# Altium schematic sheet 10-multimodal-microcontroller-rf.SchDoc
size A; SheetNumber: 7; SheetTotal: 11
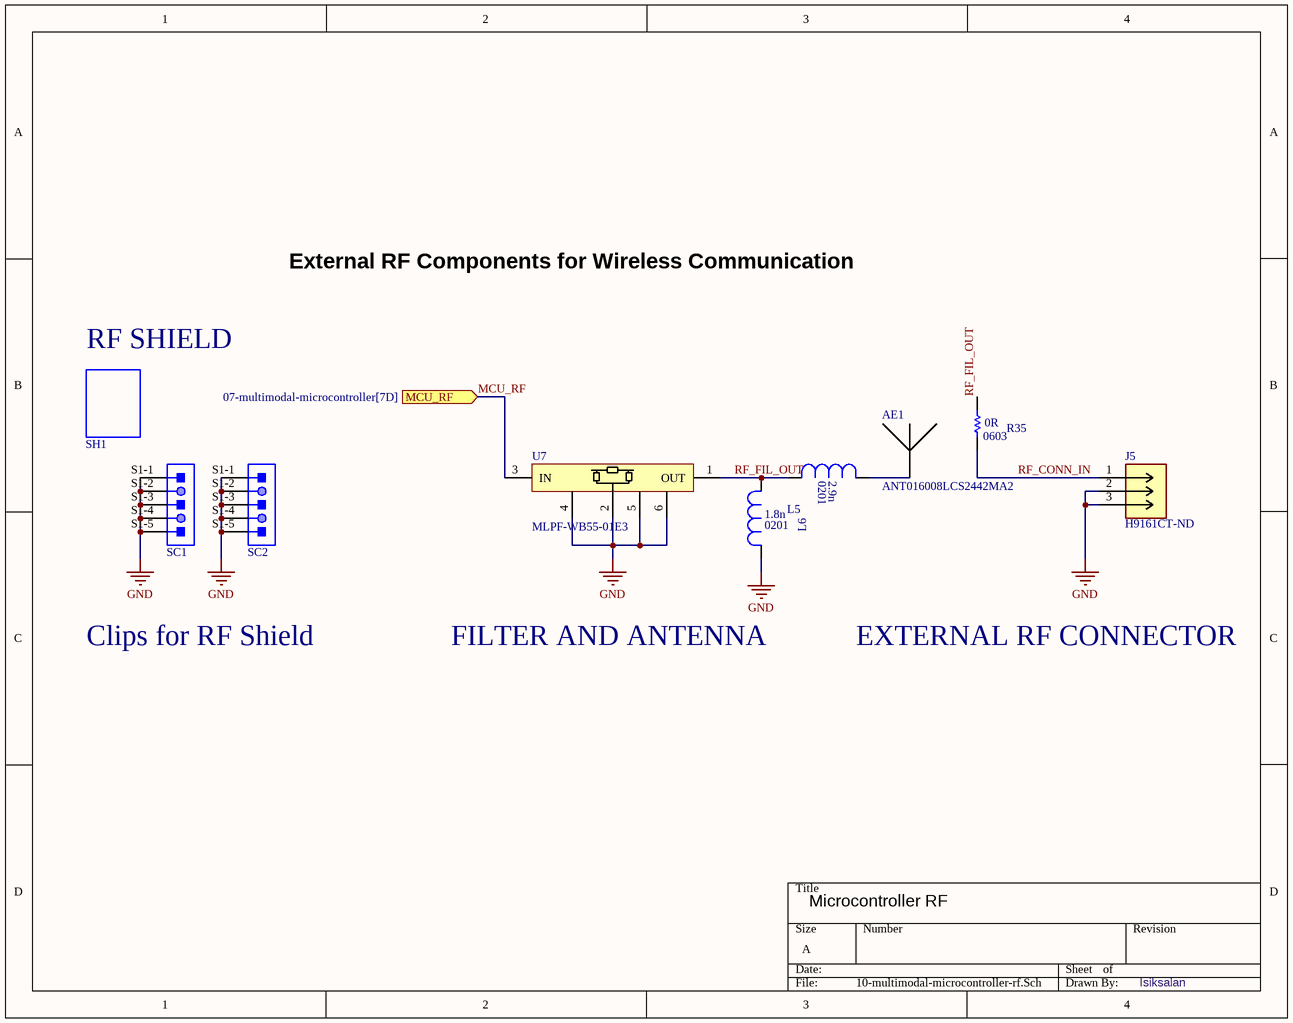
[diagram p0: 10-multimodal-microcontroller-rf.SchDoc]

## Parts
AE1  ANT016008LCS2442MA2  [ANTENNA]
J5  Supplier Part Number 1: H9161CT-ND  [RF-CONNECTOR]  (hidden comment: U.FL-R-SMT(10))
L5  MLG0603P1N8CT000  [INDTDK0201]  (value not drawn)
L6  MHQ0603P2N9ST000  [INDTDK0201]  (value not drawn)
R35  RMCF0603ZT0R00  [RES-STACK-POLE-0603]  (value not drawn)
SC1  S0951-46R  [RF-SHIELD+CLIP]  (value not drawn)
SC2  S0951-46R  [RF-SHIELD+CLIP]  (value not drawn)
SH1  MS190-10C  (value not drawn)
U7  MLPF-WB55-01E3  [Matched-Filter-2.4GHz]

## Ports
MCU_RF (in, see 07-multimodal-microcontroller[7D])

## Nets
GND: J5.2 J5.3 L5.2 SC1.S1-1 SC1.S1-2 SC1.S1-3 SC1.S1-4 SC1.S1-5 SC2.S1-1 SC2.S1-2 SC2.S1-3 SC2.S1-4 SC2.S1-5 U7.2 U7.4 U7.5 U7.6
MCU_RF: U7.3(IN) ; port MCU_RF
RF_CONN_IN: J5.1 R35.1
RF_FIL_OUT: L5.1 L6.2 R35.2 U7.1(OUT)
NetAE1_2: AE1.2 L6.1

## Notes on the sheet
- External RF Components for Wireless Communication
- RF SHIELD
- Clips for RF Shield
- FILTER AND ANTENNA
- EXTERNAL RF CONNECTOR
- Microcontroller RF
- Isiksalan
- (in symbol MHQ0603P2N9ST000) 0201; 2.9n
- (in symbol MLG0603P1N8CT000) 1.8n; 0201
- (in symbol RMCF0603ZT0R00) 0R; 0603

## Library data of the parts
AE1 = ANT016008LCS2442MA2: TDK - ANT016008LCS2442MA2 - Chip Antenna, ISM, 2.442 GHz, 50 Ohm, 1.6mm x 0.8mm x 0.4mm; Number of Bands: 1; Max Frequency: 27MHz; Supplier 1: Digi-Key; Manufacturer: TDK; Manufacturer Part Number: ANT016008LCS2442MA2; RoHS: Yes; Category: RF Antennas; Stock 1: 16359; Pricing 1: 1=0.72000, 10=0.63500, 25=0.59680, 100=0.48700, 250=0.45236, 500=0.38500, 1000=0.30800 (USD); Mount: Surface Mount; Case/Package: 0603; Number of Pins: 6; Packaging: Cut Tape; Termination: Solder; Height: 0.016inch; REACH SVHC: No SVHC; RoHS Compliant: Yes; ComponentLink1URL: http://www.farnell.com/datasheets/2294435.pdf?src-supplier=Farnell; ComponentLink1Description: http://www.farnell.com/datasheets/2294435.pdf?src-supplier=Farnell; ComponentLink2URL: https://product.tdk.com/info/en/documents/data_sheet/rf_ant_ant016008lcs2442ma2_summary_en.pdf?src-supplier=Digi-Key; ComponentLink2Description: https://product.tdk.com/info/en/documents/data_sheet/rf_ant_ant016008lcs2442ma2_summary_en.pdf?src-supplier=Digi-Key; ComponentLink3URL: https://product.tdk.com/info/en/documents/data_sheet/rf_ant_ant016008lcs2442ma2_en.pdf?src-supplier=Avnet; ComponentLink3Description: https://product.tdk.com/info/en/documents/data_sheet/rf_ant_ant016008lcs2442ma2_en.pdf?src-supplier=Avnet; ComponentLink4URL: http://www.farnell.com/datasheets/1932405.pdf?src-supplier=Element14; ComponentLink4Description: http://www.farnell.com/datasheets/1932405.pdf?src-supplier=Element14; Supplier Part Number 1: 445-172405CT-ND
J5 = U.FL-R-SMT(10): CONN U.FL RCPT STR 50 OHM SMD; Manufacturer: Hirose; Copyright: Copyright (C) 2021 Ultra Librarian. All rights reserved.; Manufacturer Part Number: U.FL-R-SMT(10); Digi-Key_Part_Number_1: H9161TR-ND; Digi-Key_Part_Number_2: H9161CT-ND; Digi-Key_Part_Number_3: H9161DKR-ND; Digi-Key_Part_Number_4: H9161TR-NDL; RefDes: RefDes; Type: DEV; Supplier 1: Digi-Key
L5 = MLG0603P1N8CT000: FIXED IND 1.8NH 700MA 100MOHM SM; Supplier 1: Digi-Key; Supplier Part Number 1: 445-172430-1-ND
L6 = MHQ0603P2N9ST000: FIXED IND 2.9NH 450MA 300MOHM SM; Supplier 1: Digi-Key; Supplier Part Number 1: 445-16842-6-ND
R35 = RMCF0603ZT0R00: RES 0 OHM JUMPER 1/10W 0603; Supplier 1: Digi-Key; Supplier Part Number 1: RMCF0603ZT0R00CT-ND
SC1 SC2 = S0951-46R: RFI SHIELD CLIP MINI TIN SMD; Supplier 1: Digi-Key; Supplier Part Number 1: 952-2669-1-ND
SH1 = MS190-10C: RF SHLD COVER 0.563"X0.764" SNAP; Supplier 1: Digi-Key; Supplier Part Number 1: 2333-MS190-10C-ND
U7 = MLPF-WB55-01E3: 2.4 GHz Matched filter companion chip for STM32WB55Cx and STM32WB55Rx; Manufacturer: STMicroelectronics; Supplier 1: Digi-Key; Manufacturer Part Number: MLPF-WB55-01E3; RoHS: Yes; Stock 1: 16369; Pricing 1: 1=0.30000, 10=0.28300, 25=0.26960, 50=0.26100, 100=0.25230, 250=0.23924, 500=0.20010, 1000=0.15530 (USD); ComponentLink1URL: http://www.farnell.com/datasheets/2802556.pdf?src-supplier=Farnell; ComponentLink1Description: http://www.farnell.com/datasheets/2802556.pdf?src-supplier=Farnell; ComponentLink2URL: http://www.farnell.com/datasheets/2802556.pdf?src-supplier=Newark; ComponentLink2Description: http://www.farnell.com/datasheets/2802556.pdf?src-supplier=Newark; Supplier Part Number 1: 497-19088-1-ND